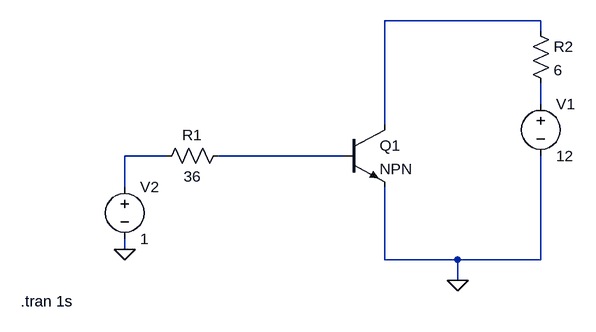
[diagram p0: schematic Transistor as Switch.asc]
Transistor as Switch.asc, the LTspice schematic file:
Version 4
SHEET 1 880 680
WIRE 496 -80 256 -80
WIRE 496 -64 496 -80
WIRE 496 48 496 16
WIRE 256 80 256 -80
WIRE -80 128 -144 128
WIRE 192 128 0 128
WIRE -144 176 -144 128
WIRE -144 272 -144 256
WIRE 256 288 256 176
WIRE 368 288 256 288
WIRE 496 288 496 128
WIRE 496 288 368 288
WIRE 368 320 368 288
FLAG -144 272 0
FLAG 368 320 0
SYMBOL npn 192 80 R0
SYMATTR InstName Q1
SYMBOL voltage 496 32 R0
WINDOW 123 0 0 Left 0
WINDOW 39 0 0 Left 0
SYMATTR InstName V1
SYMATTR Value 12
SYMBOL voltage -144 160 R0
WINDOW 123 0 0 Left 0
WINDOW 39 0 0 Left 0
SYMATTR InstName V2
SYMATTR Value 1
SYMBOL res 16 112 R90
WINDOW 0 0 56 VBottom 2
WINDOW 3 32 56 VTop 2
SYMATTR InstName R1
SYMATTR Value 36
SYMBOL res 480 -80 R0
SYMATTR InstName R2
SYMATTR Value 6
TEXT -304 352 Left 2 !.tran 1s

The netlist it stands for:
* Transistor as Switch.asc
Q1 N001 N004 0 0 NPN
V1 N002 0 12
V2 N003 0 1
R1 N004 N003 36
R2 N001 N002 6
.model NPN NPN
.model PNP PNP
.lib standard.bjt
.tran 1s
.backanno
.end